# Altium project PCB_3.PrjPcb
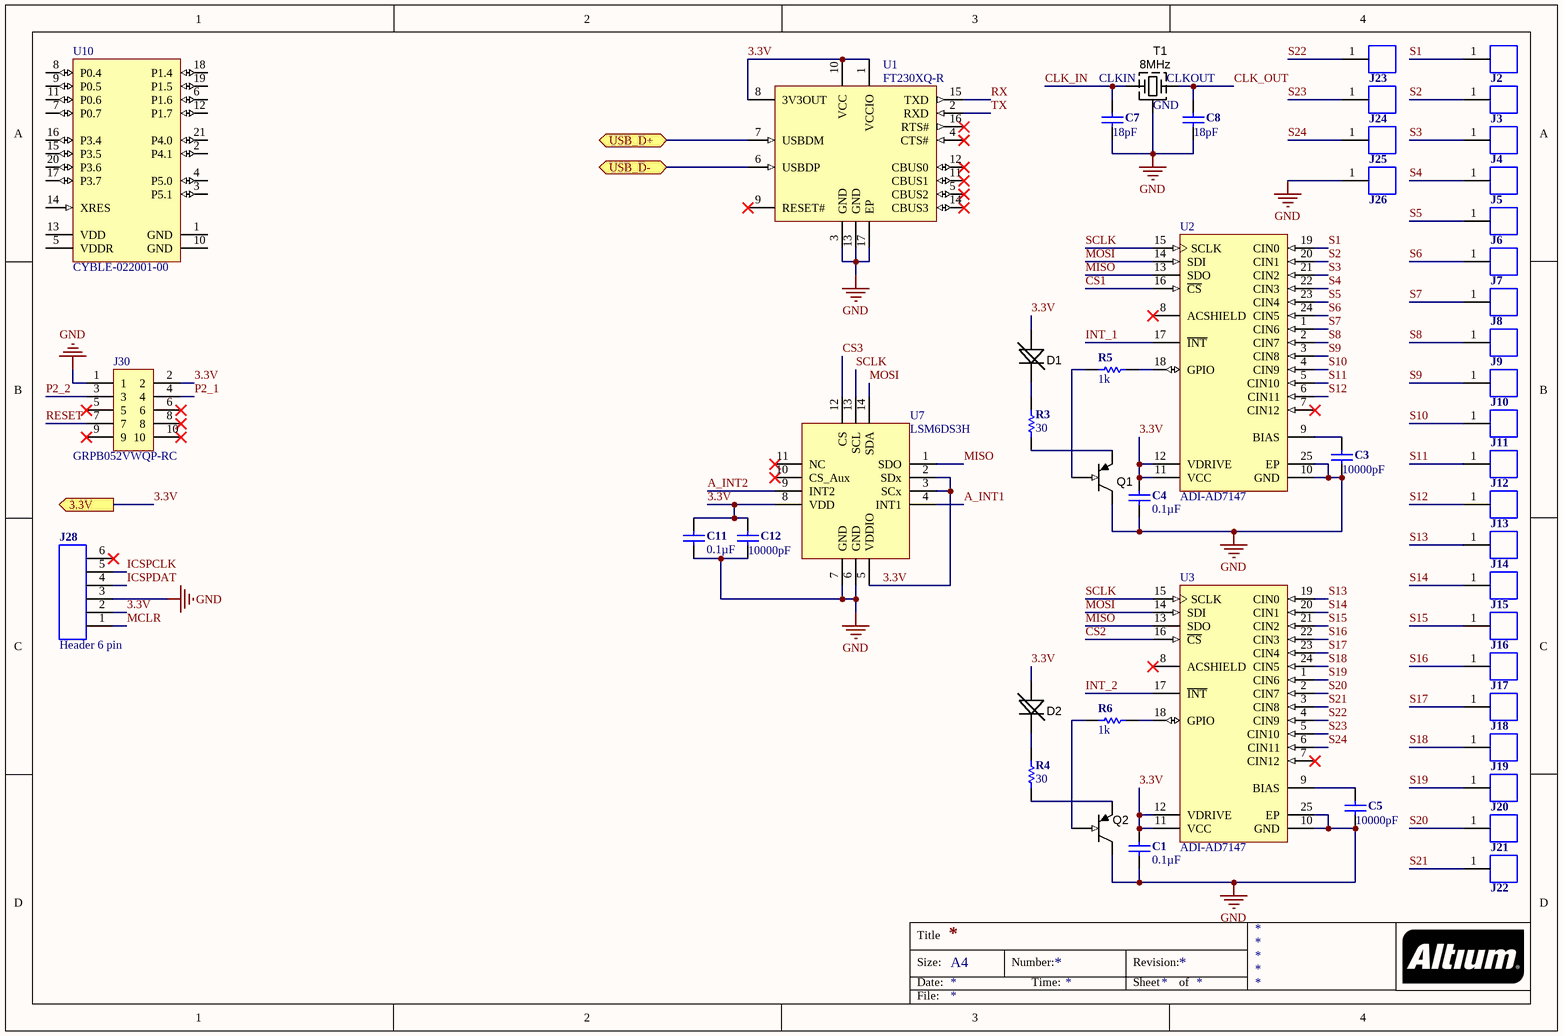
[diagram p0: Sheet-3.SchDoc]
2 sheets, 75 parts. Net scope: flat (ports and power ports of the same name join across sheets).
Board file: DB_3.PcbDoc
Sheets:
  Sheet-3.SchDoc
  Battery_3.SchDoc

## Sheet Sheet-3.SchDoc
size A4

### Parts
C1  0.1µF  [CAP-0805(2012)-R]
C3  10000pF  [CAP-0805(2012)-R]
C4  0.1µF  [CAP-0805(2012)-R]
C5  10000pF  [CAP-0805(2012)-R]
C7  18pF  [CAP-0805(2012)-R]
C8  18pF  [CAP-0805(2012)-R]
C11  0.1µF  [CAP-0805(2012)-R]
C12  10000pF  [CAP-0805(2012)-R]
D1  YELLOW  [LED-0805-A]  (value not drawn)
D2  YELLOW  [LED-0805-A]  (value not drawn)
J2  Conductive Thread  [THREAD_HOLE]  (value not drawn)
J3  Conductive Thread  [THREAD_HOLE]  (value not drawn)
J4  Conductive Thread  [THREAD_HOLE]  (value not drawn)
J5  Conductive Thread  [THREAD_HOLE]  (value not drawn)
J6  Conductive Thread  [THREAD_HOLE]  (value not drawn)
J7  Conductive Thread  [THREAD_HOLE]  (value not drawn)
J8  Conductive Thread  [THREAD_HOLE]  (value not drawn)
J9  Conductive Thread  [THREAD_HOLE]  (value not drawn)
J10  Conductive Thread  [THREAD_HOLE]  (value not drawn)
J11  Conductive Thread  [THREAD_HOLE]  (value not drawn)
J12  Conductive Thread  [THREAD_HOLE]  (value not drawn)
J13  Conductive Thread  [THREAD_HOLE]  (value not drawn)
J14  Conductive Thread  [THREAD_HOLE]  (value not drawn)
J15  Conductive Thread  [THREAD_HOLE]  (value not drawn)
J16  Conductive Thread  [THREAD_HOLE]  (value not drawn)
J17  Conductive Thread  [THREAD_HOLE]  (value not drawn)
J18  Conductive Thread  [THREAD_HOLE]  (value not drawn)
J19  Conductive Thread  [THREAD_HOLE]  (value not drawn)
J20  Conductive Thread  [THREAD_HOLE]  (value not drawn)
J21  Conductive Thread  [THREAD_HOLE]  (value not drawn)
J22  Conductive Thread  [THREAD_HOLE]  (value not drawn)
J23  Conductive Thread  [THREAD_HOLE]  (value not drawn)
J24  Conductive Thread  [THREAD_HOLE]  (value not drawn)
J25  Conductive Thread  [THREAD_HOLE]  (value not drawn)
J26  Conductive Thread  [THREAD_HOLE]  (value not drawn)
J28  Header 6 pin  [HEADER-6-100mil]
J30  GRPB052VWQP-RC  [GRPB052VWQP-RC]
Q1  (no value)  [SOT23-3]
Q2  (no value)  [SOT23-3]
R3  30  [R-0805(2012)-R]
R4  30  [R-0805(2012)-R]
R5  1k  [R-0805(2012)-R]
R6  1k  [R-0805(2012)-R]
T1  8MHz  [CRYSTAL-8MHZ]
U1  FT230XQ-R  [QFN-16]
U2  ADI-AD7147  [LFCSP_WQ]
U3  ADI-AD7147  [LFCSP_WQ]
U7  LSM6DS3H  [LGA-14]
U10  CYBLE-022001-00  [CYP-SP21_V]

### Ports
3.3V (out), USB_D+ (bidir), USB_D- (bidir)

### Nets
GND: C1.2 C3.2 C4.2 C5.2 C7.2 C8.2 C11.1 C12.1 J26.1 J28.3 J30.1 Q1.2(C) Q2.2(C) T1.2(GND) U1.3(GND) U1.13(GND) U1.17(EP) U2.10(GND) U2.25(EP) U3.10(GND) U3.25(EP) U7.6(GND) U7.7(GND)
3.3V: C1.1 C4.1 C11.2 C12.2 D1.A D2.A J28.2 J30.2 U1.1(VCCIO) U1.8(3V3OUT) U1.10(VCC) U2.11(VCC) U2.12(VDRIVE) U3.11(VCC) U3.12(VDRIVE) U7.2(SDx) U7.3(SCx) U7.5(VDDIO) U7.8(VDD) ; port 3.3V
A_INT1: U7.4(INT1)
A_INT2: U7.9(INT2)
CLK_IN: C7.1 T1.1(CLKIN)
CLK_OUT: C8.1 T1.3(X)
CS1: U2.16(~{CS})
CS2: U3.16(~{CS})
CS3: U7.12(CS)
ICSPCLK: J28.5
ICSPDAT: J28.4
INT_1: U2.17(~{INT})
INT_2: U3.17(~{INT})
MCLR: J28.1
MISO: U2.13(SDO) U3.13(SDO) U7.1(SDO)
MOSI: U2.14(SDI) U3.14(SDI) U7.14(SDA)
P2_1: J30.4
P2_2: J30.3
RESET: J30.7
RX: U1.15(TXD)
S1: J2.1 U2.19(CIN0)
S2: J3.1 U2.20(CIN1)
S3: J4.1 U2.21(CIN2)
S4: J5.1 U2.22(CIN3)
S5: J6.1 U2.23(CIN4)
S6: J7.1 U2.24(CIN5)
S7: J8.1 U2.1(CIN6)
S8: J9.1 U2.2(CIN7)
S9: J10.1 U2.3(CIN8)
S10: J11.1 U2.4(CIN9)
S11: J12.1 U2.5(CIN10)
S12: J13.1 U2.6(CIN11)
S13: J14.1 U3.19(CIN0)
S14: J15.1 U3.20(CIN1)
S15: J16.1 U3.21(CIN2)
S16: J17.1 U3.22(CIN3)
S17: J18.1 U3.23(CIN4)
S18: J19.1 U3.24(CIN5)
S19: J20.1 U3.1(CIN6)
S20: J21.1 U3.2(CIN7)
S21: J22.1 U3.3(CIN8)
S22: J23.1 U3.4(CIN9)
S23: J24.1 U3.5(CIN10)
S24: J25.1 U3.6(CIN11)
SCLK: U2.15(SCLK) U3.15(SCLK) U7.13(SCL)
TX: U1.2(RXD)
NetC3_1: C3.1 U2.9(BIAS)
NetC5_1: C5.1 U3.9(BIAS)
NetC9_2: U1.6(USBDP) ; port USB_D-
NetC10_2: U1.7(USBDM) ; port USB_D+
NetD1_K: D1.K R3.2
NetD2_K: D2.K R4.2
NetQ1_1: Q1.1(B) R5.1
NetQ1_3: Q1.3(E) R3.1
NetQ2_1: Q2.1(B) R6.2
NetQ2_3: Q2.3(E) R4.1
NetR5_2: R5.2 U2.18(GPIO)
NetR6_1: R6.1 U3.18(GPIO)

Not connected (* = marked no-connect by the designer): J28 6*; J30 5* 6* 8* 9* 10*; U1 4(CTS#)* 5(CBUS2)* 9(RESET#)* 11(CBUS1)* 12(CBUS0)* 14(CBUS3)* 16(RTS#)*; U2 7(CIN12)* 8(ACSHIELD)*; U3 7(CIN12)* 8(ACSHIELD)*; U7 10(CS_Aux)* 11(NC)*; U10 1(GND) 2(P4.1) 3(P5.1) 4(P5.0) 5(VDDR) 6(P1.6) 7(P0.7) 8(P0.4) 9(P0.5) 10(GND) 11(P0.6) 12(P1.7) 13(VDD) 14(XRES) 15(P3.5) 16(P3.4) 17(P3.7) 18(P1.4) 19(P1.5) 20(P3.6) 21(P4.0)

### Notes on the sheet
- Title
- Size:
- Date:
- A4
- Number:
- Time:
- Revision:
- Sheet
- of
- File:
- (in symbol CRYSTAL_8MHz) CLKOUT

### Library data of the parts
C1 C4 C11 = C-0805(2012): ___ OHM ___ mW 0805(2012) SMD; Manufacturer: Yageo; Manufacturer Part Number: CC0805KRX7R9BB104; Tolerance: ±10%; Voltage - Rated: 50V; Temperature Coefficient: X7R; Supplier 1: Digi-Key; Supplier Part Number 1: 311-1140-1-ND; RoHS: RoHS Compliant; Category: Capacitors; Packaging: Cut Tape (CT); Part Status: Active; Capacitance: 0.1µF; Operating Temperature: -55°C ~ 125°C; Features: -; Ratings: -; Applications: General Purpose; Failure Rate: -; Mounting Type: Surface Mount, MLCC; Package / Case: 0805 (2012 Metric); Size / Dimension: 0.079" L x 0.049" W (2.00mm x 1.25mm); Height - Seated (Max): -; Thickness (Max): 0.033" (0.85mm); Lead Spacing: -; Lead Style: -
  C1 C4: Stock 1: 1673347; Pricing 1: 1=0.1, 10=0.052, 25=0.0376, 50=0.0282, 100=0.023, 250=0.01928, 500=0.01646, 1000=0.01294 (USD); ComponentLink1URL: http://www.yageo.com/documents/recent/UPY-GPHC_X7R_6.3V-to-50V_16.pdf; ComponentLink1Description: http://www.yageo.com/documents/recent/UPY-GPHC_X7R_6.3V-to-50V_16.pdf
  C11: Stock 1: 1402266; Pricing 1: 1=0.1, 10=0.053, 25=0.0388, 50=0.029, 100=0.0237, 250=0.0198, 500=0.0169, 1000=0.01328 (USD); ComponentLink1URL: http://www.yageo.com/documents/recent/UPY-GPHC_X7R_6.3V-to-50V_17.pdf; ComponentLink1Description: http://www.yageo.com/documents/recent/UPY-GPHC_X7R_6.3V-to-50V_17.pdf
C3 C5 C12 = C-0805(2012): ___ OHM ___ mW 0805(2012) SMD; Manufacturer: Yageo; Manufacturer Part Number: CC0805KRX7R9BB103; Tolerance: ±10%; Voltage - Rated: 50V; Temperature Coefficient: X7R; Supplier 1: Digi-Key; Supplier Part Number 1: 311-1136-1-ND; RoHS: RoHS Compliant; Category: Capacitors; Packaging: Cut Tape (CT); Part Status: Active; Capacitance: 10000pF; Operating Temperature: -55°C ~ 125°C; Features: -; Ratings: -; Applications: General Purpose; Failure Rate: -; Mounting Type: Surface Mount, MLCC; Package / Case: 0805 (2012 Metric); Size / Dimension: 0.079" L x 0.049" W (2.00mm x 1.25mm); Height - Seated (Max): -; Thickness (Max): 0.024" (0.60mm); Lead Spacing: -; Lead Style: -
  C3 C5: Stock 1: 786089; Pricing 1: 1=0.1, 10=0.032, 25=0.0232, 50=0.0174, 100=0.0141, 250=0.01184, 500=0.0101, 1000=0.00794 (USD); ComponentLink1URL: http://www.yageo.com/documents/recent/UPY-GPHC_X7R_6.3V-to-50V_16.pdf; ComponentLink1Description: http://www.yageo.com/documents/recent/UPY-GPHC_X7R_6.3V-to-50V_16.pdf
  C12: Stock 1: 501331; Pricing 1: 1=0.1, 10=0.033, 25=0.0236, 50=0.0178, 100=0.0145, 250=0.01216, 500=0.01036, 1000=0.00814 (USD); ComponentLink1URL: http://www.yageo.com/documents/recent/UPY-GPHC_X7R_6.3V-to-50V_17.pdf; ComponentLink1Description: http://www.yageo.com/documents/recent/UPY-GPHC_X7R_6.3V-to-50V_17.pdf
C7 C8 = C-0805(2012): ___ OHM ___ mW 0805(2012) SMD; Manufacturer: Yageo; Manufacturer Part Number: CC0805JRNPO9BN180; Tolerance: ±5%; Voltage - Rated: 50V; Temperature Coefficient: C0G, NP0; Supplier 1: Digi-Key; Supplier Part Number 1: 311-1102-1-ND; RoHS: RoHS Compliant; Category: Capacitors; Stock 1: 101710; Pricing 1: 1=0.1, 10=0.055, 25=0.0396, 50=0.0298, 100=0.0243, 250=0.02032, 500=0.01734, 1000=0.01363 (USD); Packaging: Cut Tape (CT); Part Status: Active; Capacitance: 18pF; Operating Temperature: -55°C ~ 125°C; Features: -; Ratings: -; Applications: General Purpose; Failure Rate: -; Mounting Type: Surface Mount, MLCC; Package / Case: 0805 (2012 Metric); Size / Dimension: 0.079" L x 0.049" W (2.00mm x 1.25mm); Height - Seated (Max): -; Thickness (Max): 0.024" (0.60mm); Lead Spacing: -; Lead Style: -; ComponentLink1URL: http://www.yageo.com/NewPortal/yageodocoutput?fileName=/pdf/MLCC/UPY-GP_NP0_16V-to-50V_14.pdf; ComponentLink1Description: http://www.yageo.com/NewPortal/yageodocoutput?fileName=/pdf/MLCC/UPY-GP_NP0_16V-to-50V_14.pdf
D1 D2 = LED_0805_YELLOW: LED, 0805 SMD, YELLOW; Manufacturer: OSRAM Opto Semiconductors Inc.; Manufacturer Part Number: LY R976-PS-36; Lens Color: White; Lens Transparency: Diffused; Millicandela Rating: 162.5mcd; Lens Style/Size: Rectangle with Flat Top, 1.30mm x 1.25mm; Voltage - Forward (Vf) (Typ): 2V; Current - Test: 20mA; Viewing Angle: 160°; Wavelength - Dominant: 588nm; Wavelength - Peak: 591nm; Supplier 1: Digi-Key; RoHS: RoHS Compliant; Category: Optoelectronics; Stock 1: 77170; Pricing 1: 1=0.26, 10=0.19, 25=0.1396, 100=0.0998, 250=0.06788, 500=0.0599, 1000=0.04692 (USD); Packaging: Cut Tape (CT); Part Status: Active; Color: Yellow; Mounting Type: Surface Mount; Features: -; Package / Case: 0805 (2012 Metric); Supplier Device Package: 0805; Size / Dimension: 2.00mm L x 1.25mm W; Height (Max): 0.90mm; ComponentLink1URL: http://www.osram-os.com/Graphics/XPic9/00078941_0.pdf; ComponentLink1Description: http://www.osram-os.com/Graphics/XPic9/00078941_0.pdf; Supplier Part Number 1: 475-2560-1-ND
J2-J26 = CON-1_Pin_Thread: Header, 1 pin, Conductive Thread
J28 = CON-6Pin-100Mil: Header, 6 pin, .1 pitch; Manufacturer: Amphenol FCI; Manufacturer Part Number: 68000-406HLF; Number of Positions: 6; Pitch - Mating: 0.100" (2.54mm); Style: Board to Board; Shrouding: Unshrouded; Number of Positions Loaded: All; Contact Length - Mating: 0.230" (5.84mm); Contact Length - Post: 0.095" (2.41mm); Overall Contact Length: 0.425" (10.80mm); Material Flammability Rating: UL94 V-0; Supplier 1: Digi-Key; Category: Connectors, Interconnects; Stock 1: 11680; Pricing 1: 1=0.25, 10=0.233, 100=0.1615, 500=0.13662, 1000=0.11178, 5000=0.09936, 10000=0.09005 (USD); Current Rating: -; Number of Rows: 1; Contact Material: Phosphor Bronze; ComponentLink1URL: http://portal.fciconnect.com/Comergent//fci/drawing/68000.pdf; ComponentLink1Description: http://portal.fciconnect.com/Comergent//fci/drawing/68000.pdf; Supplier Part Number 1: 609-3263-ND; RoHS: RoHS Compliant; Packaging: Bulk; Part Status: Active; Connector Type: Header; Contact Type: Male Pin; Row Spacing - Mating: -; Mounting Type: Through Hole; Termination: Solder; Fastening Type: -; Insulation Height: 0.100" (2.54mm); Contact Shape: Square; Contact Finish - Mating: Tin; Contact Finish Thickness - Mating: 100µin (2.54µm); Contact Finish - Post: Tin; Insulation Material: -; Features: -; Operating Temperature: -; Ingress Protection: -; Insulation Color: Black; Voltage Rating: -; Mated Stacking Heights: -; Contact Finish Thickness - Post: -; Applications: -
J30 = GRPB052VWQP-RC: CONN HEADER .050" 10PS DL SMD AU; Manufacturer: Sullins Connector Solutions; Connector Type: Header, Unshrouded; Number of Positions: 10; Number of Positions Loaded: All; Pitch: 0.050" (1.27mm); Supplier 1: Digi-Key; Manufacturer Part Number: GRPB052VWQP-RC; RoHS: RoHS Compliant; Category: Connectors, Interconnects; Stock 1: 16500; Pricing 1: 1=1.3, 10=1.083, 25=1.0024, 50=0.9022, 100=0.802, 250=0.70176, 500=0.6416, 1000=0.58145, 2500=0.5213 (USD); Packaging: Bulk; Contact Type: Male Pin; Number of Rows: 2; Row Spacing: 0.050" (1.27mm); Contact Mating Length: 0.118" (3.00mm); Mounting Type: Surface Mount; Termination: Solder; Fastening Type: -; Features: Board Guide; Contact Finish: Gold; Contact Finish Thickness: Flash; Color: -; ComponentLink1URL: http://www.sullinscorp.com/catalogs/85_PAGE90-91_.050_MALE_HDR_ST_RA_SMT.pdf; ComponentLink1Description: http://www.sullinscorp.com/catalogs/85_PAGE90-91_.050_MALE_HDR_ST_RA_SMT.pdf; Supplier Part Number 1: S9013E-05-ND
Q1 Q2 = FMMT591CT-ND: Transistor PNP; Manufacturer: Diodes Incorporated; Manufacturer Part Number: FMMT591TA; Current - Collector (Ic) (Max): 1A; Voltage - Collector Emitter Breakdown (Max): 60V; Vce Saturation (Max) @ Ib, Ic: 350mV @ 100mA, 1A; Current - Collector Cutoff (Max): 100nA; DC Current Gain (hFE) (Min) @ Ic, Vce: 100 @ 500mA, 5V; Power - Max: 500mW; Frequency - Transition: 150MHz; Supplier 1: Digi-Key; RoHS: RoHS Compliant; Category: Discrete Semiconductor Products; Stock 1: 2485; Pricing 1: 1=0.45, 10=0.363, 100=0.2472, 500=0.1854, 1000=0.13905 (USD); Packaging: Cut Tape (CT); Part Status: Active; Transistor Type: PNP; Operating Temperature: -55°C ~ 150°C (TJ); Mounting Type: Surface Mount; Package / Case: TO-236-3, SC-59, SOT-23-3; Supplier Device Package: SOT-23-3; ComponentLink1URL: http://www.diodes.com/_files/datasheets/FMMT591.pdf; ComponentLink1Description: http://www.diodes.com/_files/datasheets/FMMT591.pdf; Supplier Part Number 1: FMMT591CT-ND
R3 R4 = R-0805(2012): ___ OHM ___ mW 0805(2012) SMD; Manufacturer: Yageo; Manufacturer Part Number: RC0805JR-0730RL; Tolerance: ±5%; Power (Watts): 0.125W, 1/8W; Temperature Coefficient: ±100ppm/°C; Supplier 1: Digi-Key; Supplier Part Number 1: 311-30ARCT-ND; RoHS: RoHS Compliant; Category: Resistors; Stock 1: 59788; Pricing 1: 1=0.1, 10=0.016, 25=0.0116, 50=0.009, 100=0.0066, 250=0.00504, 500=0.00404, 1000=0.00297 (USD); Packaging: Cut Tape (CT); Part Status: Active; Resistance (Ohms): 30; Composition: Thick Film; Features: Moisture Resistant; Operating Temperature: -55°C ~ 155°C; Package / Case: 0805 (2012 Metric); Supplier Device Package: 0805; Size / Dimension: 0.079" L x 0.049" W (2.00mm x 1.25mm); Height - Seated (Max): 0.024" (0.60mm); Failure Rate: -; ComponentLink1URL: http://www.yageo.com/documents/recent/PYu-RC_Group_51_RoHS_L_7.pdf; ComponentLink1Description: http://www.yageo.com/documents/recent/PYu-RC_Group_51_RoHS_L_7.pdf
R5 R6 = R-0805(2012): ___ OHM ___ mW 0805(2012) SMD; Manufacturer: Yageo; Manufacturer Part Number: RC0805JR-071KL; Tolerance: ±5%; Power (Watts): 0.125W, 1/8W; Temperature Coefficient: ±100ppm/°C; Supplier 1: Digi-Key; Supplier Part Number 1: 311-1.0KARCT-ND; RoHS: RoHS Compliant; Category: Resistors; Stock 1: 1174465; Pricing 1: 1=0.1, 10=0.016, 25=0.0116, 50=0.009, 100=0.0066, 250=0.00504, 500=0.00404, 1000=0.00297 (USD); Packaging: Cut Tape (CT); Part Status: Active; Resistance (Ohms): 1k; Composition: Thick Film; Features: Moisture Resistant; Operating Temperature: -55°C ~ 155°C; Package / Case: 0805 (2012 Metric); Supplier Device Package: 0805; Size / Dimension: 0.079" L x 0.049" W (2.00mm x 1.25mm); Height - Seated (Max): 0.024" (0.60mm); Failure Rate: -; ComponentLink1URL: http://www.yageo.com/documents/recent/PYu-RC_Group_51_RoHS_L_7.pdf; ComponentLink1Description: http://www.yageo.com/documents/recent/PYu-RC_Group_51_RoHS_L_7.pdf
T1 = CRYSTAL_8MHz: Oscillator Crystal 8MHz 10ppm; Manufacturer: Abracon LLC; Manufacturer Part Number: ABMM2-8.000MHZ-E2-T; Frequency Stability: ±20ppm; Load Capacitance: 18pF; Type: MHz Crystal; ESR (Equivalent Series Resistance): 72 Ohm; Operating Mode: Fundamental; Supplier 1: Digi-Key; RoHS: RoHS Compliant; Category: Crystals, Oscillators, Resonators; Stock 1: 56825; Pricing 1: 1=0.82, 10=0.721, 50=0.674, 100=0.5957, 500=0.5643 (USD); Frequency: 8MHz; Package / Case: 4-SMD, No Lead; Packaging: Cut Tape (CT); ComponentLink1URL: http://www.abracon.com/Resonators/ABMM2.pdf; ComponentLink1Description: http://www.abracon.com/Resonators/ABMM2.pdf; Supplier Part Number 1: 535-9628-1-ND; Part Status: Active; Frequency Tolerance: ±20ppm; Operating Temperature: -20°C ~ 70°C; Ratings: -; Mounting Type: Surface Mount; Size / Dimension: 0.240" L x 0.142" W (6.00mm x 3.60mm); Height - Seated (Max): 0.047" (1.20mm)
U1 = FT230XQ-R: USB to Basic UART Interface Chip, UHCI/OHCI/EHCI Compatible, USB 2.0 Compatible, -40 to +85 degC, 16-Pin QFN, Pb-Free, Tape and Reel; Manufacturer: FTDI, Future Technology Devices International Ltd; Function: Bridge, USB to UART; Standards: USB 2.0; Voltage - Supply: 3.3 V ~ 5 V; Current - Supply: 8mA; Supplier 1: Digi-Key; Manufacturer Part Number: FT230XQ-R; RoHS: RoHS Compliant; Category: Integrated Circuits (ICs); Stock 1: 40408; Pricing 1: 1=2.3, 25=1.97, 100=1.9, 250=1.71, 500=1.55, 1000=1.53001 (USD); Package / Case: 16-WQFN Exposed Pad; Packaging: Cut Tape (CT); ComponentLink1URL: http://www.ftdichip.com/Support/Documents/DataSheets/ICs/DS_FT230X.pdf; ComponentLink1Description: http://www.ftdichip.com/Support/Documents/DataSheets/ICs/DS_FT230X.pdf; Supplier Part Number 1: 768-1130-1-ND; Part Status: Active; Protocol: USB; Interface: UART; Operating Temperature: -40°C ~ 85°C; Supplier Device Package: 16-QFN (4x4)
U2 U3 = ADI-AD7147: Manufacturer: Analog Devices Inc.; Manufacturer Part Number: AD7147PACPZ-500R7; Resolution (Bits): 16 b; Sampling Rate (Per Second): 250k; Data Interface: SPI; Voltage Supply Source: Single Supply; Voltage - Supply: 2.6 V ~ 3.6 V; Supplier 1: Digi-Key; RoHS: RoHS Compliant; Category: Integrated Circuits (ICs); Stock 1: 559; Pricing 1: 1=3.6, 10=3.236, 100=2.6512 (USD); Packaging: Cut Tape (CT); Part Status: Active; Type: Capacitance-to-Digital Converter; Operating Temperature: -40°C ~ 85°C; Mounting Type: Surface Mount; Package / Case: 24-WFQFN Exposed Pad, CSP; Supplier Device Package: 24-LFCSP-WQ (4x4); ComponentLink1URL: http://www.analog.com/media/en/technical-documentation/data-sheets/AD7147.pdf; ComponentLink1Description: http://www.analog.com/media/en/technical-documentation/data-sheets/AD7147.pdf; Supplier Part Number 1: AD7147PACPZ-500R7CT-ND
U7 = LSM6DS3H: 3D accelerometer and 3D gyroscope; Manufacturer: STMicroelectronics; Manufacturer Part Number: LSM6DS3HTR; Sensor Type: Accelerometer, Gyroscope, Temperature, 6 Axis; Output Type: I²C, SPI; Supplier 1: Digi-Key; RoHS: RoHS Compliant; Category: Sensors, Transducers; Stock 1: 34853; Pricing 1: 1=3.98, 10=3.572, 100=2.9264 (USD); Part Status: Active; Operating Temperature: -40°C ~ 85°C (TA); ComponentLink1URL: http://www.st.com/content/ccc/resource/technical/document/datasheet/group0/38/96/79/af/ab/62/42/c3/DM00229854/files/DM00229854.pdf/jcr:content/translations/en.DM00229854.pdf; ComponentLink1Description: http://www.st.com/content/ccc/resource/technical/document/datasheet/group0/38/96/79/af/ab/62/42/c3/DM00229854/files/DM00229854.pdf/jcr:content/translations/en.DM00229854.pdf; Supplier Part Number 1: 497-16367-1-ND
U10 = CMP-2000-05093-1: RF Transceiver Module, 128 kB Flash, -40 to 85 degC, 21-Pin Module, RoHS; Manufacturer: CypressSemiconductorCorp; Antenna Type: Integrated,Chip; Voltage - Supply: 1.8V~4.5V; Power - Output: 3dBm; Data Rate: 1Mbps; Memory Size: 128kBFlash,16kBSRAM; Sensitivity: -91dBm; Frequency: 2.4GHz; Current - Transmitting: 15.6mA; Serial Interfaces: I²C,SPI,UART; Current - Receiving: 16.4mA; RF Family/Standard: Bluetooth; Protocol: Bluetoothv4.1; Modulation: -; Mounting Type: SurfaceMount; Datasheet URL: http://www.cypress.com/file/140791/download; Datasheet Version: Rev. *E, 02/2016; Package / Case: Module; Category: RF/IFandRFID; Manufacturer URL: http://www.cypress.com/; Series: EZ-BLE™PRoC™; Packaging: Tape&amp;Reel(TR); Operating Temperature: -40degC~85degC; Family: RFTransceiverModules

## Sheet Battery_3.SchDoc
size A4
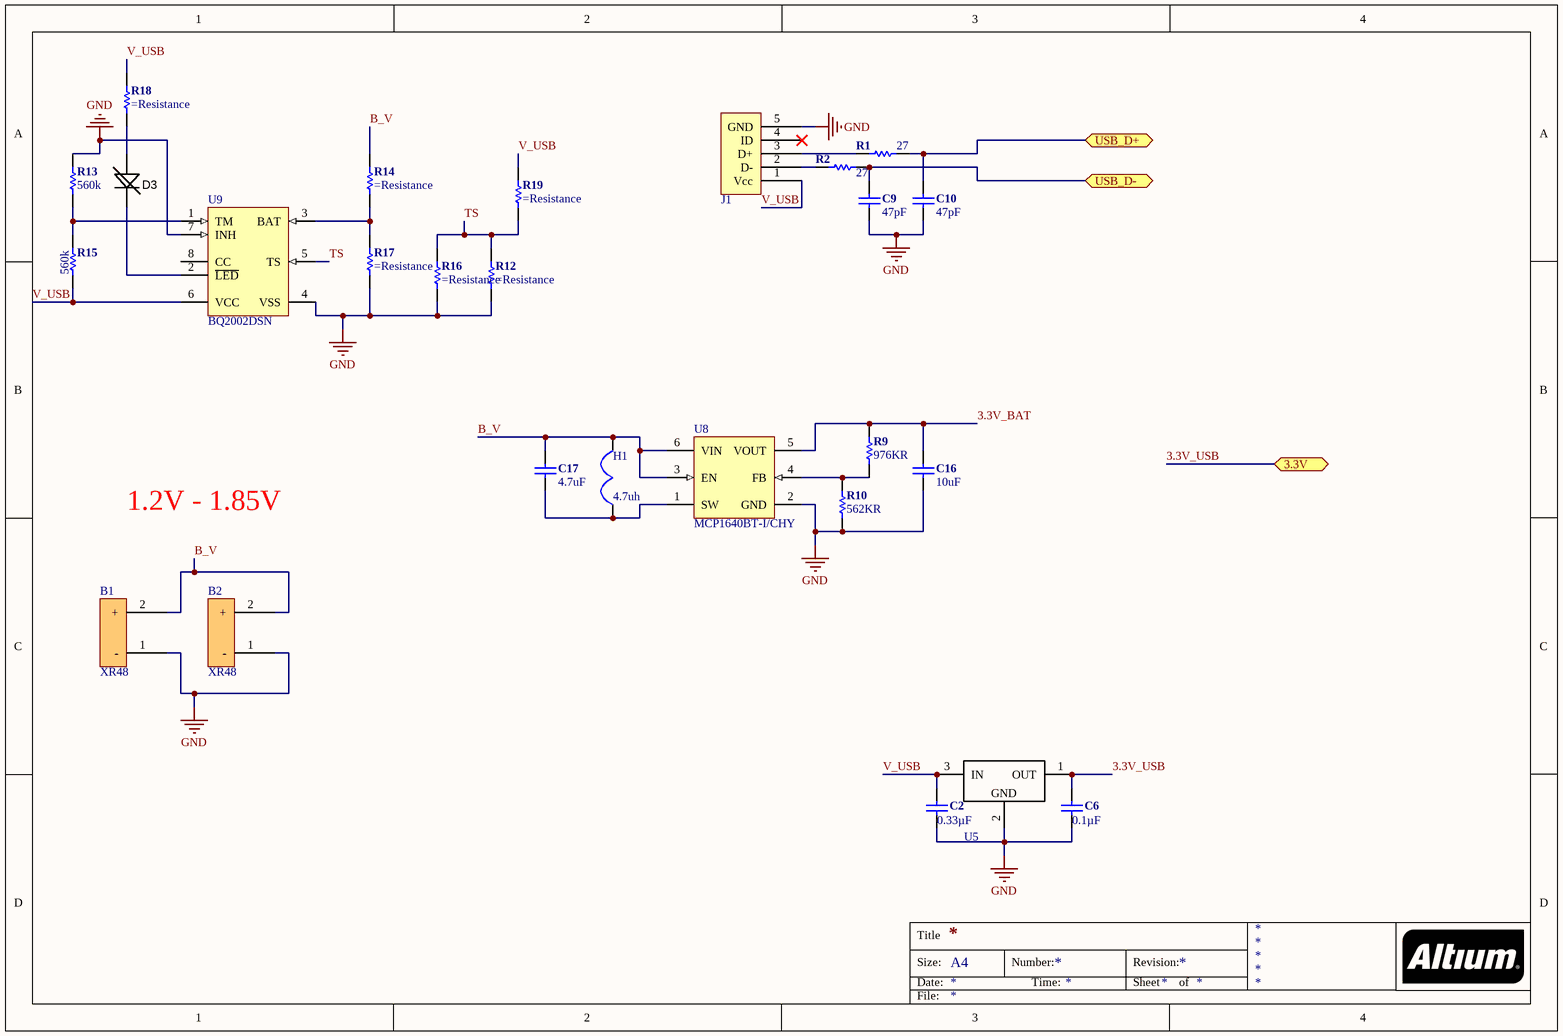
[diagram p1: Battery_3.SchDoc]

### Parts
B1  XR48  [XR48]
B2  XR48  [XR48]
C2  0.33µF  [CAP-0805(2012)-R]
C6  0.1µF  [CAP-0805(2012)-R]
C9  47pF  [CAP-0805(2012)-R]
C10  47pF  [CAP-0805(2012)-R]
C16  10uF  [CAP-0805(2012)-R]
C17  4.7uF  [CAP-0805(2012)-R]
D3  Red  [LED-0805-A]  (value not drawn)
H1  Inductance: 4.7uh  [H-0805(2012)-H]  (hidden comment: H-0805(2012))
J1  USB  [USB_Connector_5P_MICRO_USB_FCI]  (value not drawn)
R1  27  [R-0805(2012)-R]
R2  27  [R-0805(2012)-R]
R9  976KR  [R-0805(2012)-R]
R10  562KR  [R-0805(2012)-R]
R12  (no value)  [R-0805(2012)-R]
R13  560k  [R-0805(2012)-R]
R14  (no value)  [R-0805(2012)-R]
R15  560k  [R-0805(2012)-R]
R16  (no value)  [R-0805(2012)-R]
R17  (no value)  [R-0805(2012)-R]
R18  (no value)  [R-0805(2012)-R]
R19  (no value)  [R-0805(2012)-R]
U5  L78L33ACUTR  [SOT89-3]  (value not drawn)
U8  MCP1640BT-I/CHY  [MCHP-SOT-23-CHY6_L]
U9  BQ2002DSN  [D0008A_M]

### Ports
3.3V, USB_D+ (bidir), USB_D- (bidir)

### Nets
GND: B1.1(-) B2.1(-) C2.2 C6.2 C9.1 C10.1 C16.2 J1.5(GND) R10.2 R12.2 R13.1 R16.2 R17.2 U5.2(GND) U8.2(GND) U9.4(VSS) U9.7(INH)
3.3V_BAT: C16.1 R9.1 U8.5(VOUT)
3.3V_USB: C6.1 U5.1(OUT) ; port 3.3V  [project net 3.3V]
B_V: B1.2(+) B2.2(+) C17.1 H1.2 R14.1 U8.3(EN) U8.6(VIN)
TS: R12.1 R16.1 R19.2 U9.5(TS)
V_USB: C2.1 J1.1(Vcc) R15.2 R18.1 R19.1 U5.3(IN) U9.6(VCC)
NetC9_2: C9.2 R2.2 ; port USB_D-
NetC10_2: C10.2 R1.2 ; port USB_D+
NetC17_2: C17.2 H1.1 U8.1(SW)
NetD3_A: D3.A R18.2
NetD3_K: D3.K U9.2(~{LED})
NetJ1_2: J1.2(D-) R2.1
NetJ1_3: J1.3(D+) R1.1
NetR9_2: R9.2 R10.1 U8.4(FB)
NetR13_2: R13.2 R15.1 U9.1(TM)
NetR14_2: R14.2 R17.1 U9.3(BAT)

Not connected (* = marked no-connect by the designer): J1 4(ID)*; U9 8(CC)

### Notes on the sheet
- 1.2V - 1.85V
- Title
- Size:
- Date:
- A4
- Number:
- Time:
- Revision:
- Sheet
- of
- File:

### Library data of the parts
C2 = C-0805(2012): ___ OHM ___ mW 0805(2012) SMD; Manufacturer: Yageo; Manufacturer Part Number: CC0805KKX7R7BB334; Tolerance: ±10%; Voltage - Rated: 16V; Temperature Coefficient: X7R; Supplier 1: Digi-Key; Supplier Part Number 1: 311-1882-1-ND; RoHS: RoHS Compliant; Category: Capacitors; Stock 1: 5738; Pricing 1: 1=0.19, 10=0.129, 25=0.0948, 50=0.0776, 100=0.0655, 250=0.05344, 500=0.04482, 1000=0.03965 (USD); Packaging: Cut Tape (CT); Part Status: Active; Capacitance: 0.33µF; Operating Temperature: -55°C ~ 125°C; Features: -; Ratings: -; Applications: General Purpose; Failure Rate: -; Mounting Type: Surface Mount, MLCC; Package / Case: 0805 (2012 Metric); Size / Dimension: 0.079" L x 0.049" W (2.00mm x 1.25mm); Height - Seated (Max): -; Thickness (Max): 0.057" (1.45mm); Lead Spacing: -; Lead Style: -; ComponentLink1URL: http://www.yageo.com/documents/recent/UPY-GPHC_X7R_6.3V-to-50V_16.pdf; ComponentLink1Description: http://www.yageo.com/documents/recent/UPY-GPHC_X7R_6.3V-to-50V_16.pdf
C6 = C-0805(2012): as C1 on sheet Sheet-3; Supplier 1: Digi-Key; Supplier Part Number 1: 311-1140-1-ND; RoHS: RoHS Compliant; Category: Capacitors; Stock 1: 1673292; Pricing 1: 1=0.1, 10=0.052, 25=0.0376, 50=0.0282, 100=0.023, 250=0.01928, 500=0.01646, 1000=0.01294 (USD); Packaging: Cut Tape (CT); Part Status: Active; Capacitance: 0.1µF; Operating Temperature: -55°C ~ 125°C; Features: -; Ratings: -; Applications: General Purpose; Failure Rate: -; Mounting Type: Surface Mount, MLCC; Package / Case: 0805 (2012 Metric); Size / Dimension: 0.079" L x 0.049" W (2.00mm x 1.25mm); Height - Seated (Max): -; Thickness (Max): 0.033" (0.85mm); Lead Spacing: -; Lead Style: -; ComponentLink1URL: http://www.yageo.com/documents/recent/UPY-GPHC_X7R_6.3V-to-50V_16.pdf; ComponentLink1Description: http://www.yageo.com/documents/recent/UPY-GPHC_X7R_6.3V-to-50V_16.pdf
C9 C10 = C-0805(2012): ___ OHM ___ mW 0805(2012) SMD; Manufacturer: Yageo; Manufacturer Part Number: CC0805JRNPO9BN470; Tolerance: ±5%; Voltage - Rated: 50V; Temperature Coefficient: C0G, NP0; Supplier 1: Digi-Key; Supplier Part Number 1: 311-1107-1-ND; RoHS: RoHS Compliant; Category: Capacitors; Stock 1: 181638; Pricing 1: 1=0.1, 10=0.055, 25=0.0396, 50=0.0298, 100=0.0243, 250=0.02032, 500=0.01734, 1000=0.01363 (USD); Packaging: Cut Tape (CT); Part Status: Active; Capacitance: 47pF; Operating Temperature: -55°C ~ 125°C; Features: -; Ratings: -; Applications: General Purpose; Failure Rate: -; Mounting Type: Surface Mount, MLCC; Package / Case: 0805 (2012 Metric); Size / Dimension: 0.079" L x 0.049" W (2.00mm x 1.25mm); Height - Seated (Max): -; Thickness (Max): 0.024" (0.60mm); Lead Spacing: -; Lead Style: -; ComponentLink1URL: http://www.yageo.com/NewPortal/yageodocoutput?fileName=/pdf/MLCC/UPY-GP_NP0_16V-to-50V_14.pdf; ComponentLink1Description: http://www.yageo.com/NewPortal/yageodocoutput?fileName=/pdf/MLCC/UPY-GP_NP0_16V-to-50V_14.pdf
C16 = C-0805(2012): ___ OHM ___ mW 0805(2012) SMD; Manufacturer: Murata; Manufacturer Part Number: GRM219R61A106KE44D; Material: Ceramic; Voltage Rating: 10V; Tolerance: 10%; Dielectric: X5R; Supplier 1: Mouser; Supplier Part Number 1: 81-GRM219R61A106KE4D; Stock 1: 105901; Pricing 1: 1=0.2, 10=0.084, 50=0.084, 100=0.057, 1000=0.043, 10000=0.03 (USD); Mount: Surface Mount; Case/Package: 0805; Case Code (Metric): 2012; Case Code (Imperial): 0805; Min Operating Temperature: -55°C; Max Operating Temperature: 85°C; Package Quantity: 1; Capacitance: 10uF; Packaging: Tape and Reel; Voltage Rating (DC): 10V; Termination: SMD/SMT; Voltage: 10V; Length: 2mm; Height: 0.85mm; Width: 1.25mm; Thickness: 0.037inch; Depth: 1.25mm; Radiation Hardening: No; REACH SVHC: No SVHC; Lead Free: Lead Free; ComponentLink1URL: https://datasheet.ciiva.com/172/grm219r61a106ke44-01-172352.pdf; ComponentLink1Description: https://datasheet.ciiva.com/172/grm219r61a106ke44-01-172352.pdf; ComponentLink2URL: https://datasheet.ciiva.com/172/grm219r61a106ke44-01-172353.pdf; ComponentLink2Description: https://datasheet.ciiva.com/172/grm219r61a106ke44-01-172353.pdf; ComponentLink3URL: https://datasheet.ciiva.com/172/grm219r61a106ke44-01-172354.pdf; ComponentLink3Description: https://datasheet.ciiva.com/172/grm219r61a106ke44-01-172354.pdf; ComponentLink4URL: https://datasheet.ciiva.com/5414/product-5414357.pdf; ComponentLink4Description: https://datasheet.ciiva.com/5414/product-5414357.pdf; ComponentLink5URL: https://datasheet.ciiva.com/3777/54grm219r61a106ke4423-3777910.pdf; ComponentLink5Description: https://datasheet.ciiva.com/3777/54grm219r61a106ke4423-3777910.pdf; ComponentLink6URL: https://datasheet.ciiva.com/7719/c02e-7719062.pdf; ComponentLink6Description: https://datasheet.ciiva.com/7719/c02e-7719062.pdf; ComponentLink7URL: https://datasheet.ciiva.com/2989/product-2989663.pdf; ComponentLink7Description: https://datasheet.ciiva.com/2989/product-2989663.pdf; ComponentLink8URL: https://datasheet.ciiva.com/17451/product-17451791.pdf; ComponentLink8Description: https://datasheet.ciiva.com/17451/product-17451791.pdf
C17 = C-0805(2012): ___ OHM ___ mW 0805(2012) SMD; Manufacturer: Murata; Manufacturer Part Number: GRM21BR61C475KA88L; Tolerance: 10%; Voltage Rating: 16V; Dielectric: X5R; Supplier 1: Mouser; Supplier Part Number 1: 81-GRM21BR61C475KA8L; Stock 1: 95997; Pricing 1: 1=0.2, 10=0.076, 50=0.076, 100=0.053, 1000=0.037, 10000=0.027 (USD); Mount: Surface Mount; Case/Package: 0805; Case Code (Imperial): 0805; Case Code (Metric): 2012; Min Operating Temperature: -55°C; Max Operating Temperature: 85°C; Packaging: Tape and Reel; Capacitance: 4.7uF; Voltage Rating (DC): 16V; Package Quantity: 1; Termination: SMD/SMT; Voltage: 16V; Length: 2mm; Height: 1.25mm; Width: 1.25mm; Thickness: 0.053inch; Depth: 1.25mm; Radiation Hardening: No; REACH SVHC: No SVHC; Lead Free: Lead Free; ComponentLink1URL: https://datasheet.ciiva.com/2989/product-2989699.pdf; ComponentLink1Description: https://datasheet.ciiva.com/2989/product-2989699.pdf; ComponentLink2URL: https://datasheet.ciiva.com/2989/product-2989700.pdf; ComponentLink2Description: https://datasheet.ciiva.com/2989/product-2989700.pdf; ComponentLink3URL: https://datasheet.ciiva.com/16199/product-16199957.pdf; ComponentLink3Description: https://datasheet.ciiva.com/16199/product-16199957.pdf; ComponentLink4URL: https://datasheet.ciiva.com/16624/product-16624469.pdf; ComponentLink4Description: https://datasheet.ciiva.com/16624/product-16624469.pdf; ComponentLink5URL: https://datasheet.ciiva.com/22706/608985-22706821.pdf; ComponentLink5Description: https://datasheet.ciiva.com/22706/608985-22706821.pdf; ComponentLink6URL: https://datasheet.ciiva.com/3777/grm21br61c475ka8823-3777176.pdf; ComponentLink6Description: https://datasheet.ciiva.com/3777/grm21br61c475ka8823-3777176.pdf; ComponentLink7URL: https://datasheet.ciiva.com/137/product-137674.pdf; ComponentLink7Description: https://datasheet.ciiva.com/137/product-137674.pdf; ComponentLink8URL: https://datasheet.ciiva.com/137/product-137675.pdf; ComponentLink8Description: https://datasheet.ciiva.com/137/product-137675.pdf; ComponentLink9URL: https://datasheet.ciiva.com/137/product-137676.pdf; ComponentLink9Description: https://datasheet.ciiva.com/137/product-137676.pdf
D3 = LED_0805_RED: LED, 0805 SMD, Red; Manufacturer: OSRAM Opto Semiconductors Inc.; Manufacturer Part Number: LS R976-NR-1; Lens Color: White; Lens Transparency: Diffused; Millicandela Rating: 104mcd; Lens Style/Size: Rectangle with Flat Top, 1.30mm x 1.25mm; Voltage - Forward (Vf) (Typ): 2V; Current - Test: 20mA; Viewing Angle: 160°; Wavelength - Dominant: 633nm; Wavelength - Peak: 645nm; Supplier 1: Digi-Key; RoHS: RoHS Compliant; Category: Optoelectronics; Stock 1: 162363; Pricing 1: 1=0.26, 10=0.19, 25=0.1396, 100=0.0998, 250=0.06788, 500=0.0599, 1000=0.04692 (USD); Packaging: Cut Tape (CT); Part Status: Active; Color: Red; Mounting Type: Surface Mount; Features: -; Package / Case: 0805 (2012 Metric); Size / Dimension: 2.00mm L x 1.25mm W; Height (Max): 0.90mm; ComponentLink1URL: http://www.osram-os.com/Graphics/XPic8/00078896_0.pdf; ComponentLink1Description: http://www.osram-os.com/Graphics/XPic8/00078896_0.pdf; Supplier Part Number 1: 475-1278-1-ND
H1 = H-0805(2012): Manufacturer: TDK; Manufacturer Part Number: MLP2012S4R7MT0S1; Description: FIXED IND 4.7UH 700MA 260 MOHM; Core Material: Ferrite; Tolerance: 20%; Current Rating: 700mA; Shielding: Shielded; DC Resistance (DCR): 260mR; Test Frequency: 2MHz; Supplier 1: Mouser; Supplier Part Number 1: 810-MLP2012S4R7MT0S1; Stock 1: 5251; Pricing 1: 1=0.36, 10=0.254, 50=0.254, 100=0.236, 1000=0.167, 10000=0.112 (USD); Case/Package: 0805; Case Code (Metric): 2012; Case Code (Imperial): 0805; Min Operating Temperature: -40°C; Max Operating Temperature: 125°C; Package Quantity: 4000; Packaging: Tape and Reel; Length: 0.079inch; Width: 0.049inch; Height - Seated (Max): 0.039inch; ComponentLink1URL: https://datasheet.ciiva.com/41798/inductor-commercial-power-mlp-en-41798601.pdf; ComponentLink1Description: https://datasheet.ciiva.com/41798/inductor-commercial-power-mlp-en-41798601.pdf
J1 = USB: USB_Connector_5P_MICRO_USB_FCI; Manufacturer: Amphenol FCI; Manufacturer Part Number: 10118194-0001LF; Connector Type: USB - micro B; Current Rating: 1.8A per Contact; Gender: Receptacle; Number of Contacts: 5; Specifications: USB 2.0; Number of Ports: 1; Voltage - Rated: 100VAC; Mating Cycles: 10000; Shielding: Shielded; Material Flammability Rating: UL94 V-0; Supplier 1: Digi-Key; RoHS: RoHS Compliant; Category: Connectors, Interconnects; Stock 1: 267893; Pricing 1: 1=0.46, 10=0.437, 25=0.3744, 50=0.318, 100=0.3056, 250=0.27444, 500=0.26196 (USD); Packaging: Cut Tape (CT); ComponentLink1URL: http://portal.fciconnect.com/Comergent//fci/drawing/10118194.pdf; ComponentLink1Description: http://portal.fciconnect.com/Comergent//fci/drawing/10118194.pdf; Supplier Part Number 1: 609-4618-1-ND; Part Status: Active; Mounting Type: Surface Mount, Right Angle; Through Hole; Mounting Feature: Horizontal; Termination: Solder; Features: Solder Retention; Ingress Protection: -; Operating Temperature: -30°C ~ 80°C; Contact Finish: Gold; Shell/Shielding Material: Steel, Stainless; Insulation Color: Black
R1 R2 = R-0805(2012): ___ OHM ___ mW 0805(2012) SMD; Manufacturer: Yageo; Manufacturer Part Number: RC0805JR-0727RL; Tolerance: ±5%; Power (Watts): 0.125W, 1/8W; Temperature Coefficient: ±100ppm/°C; Supplier 1: Digi-Key; Supplier Part Number 1: 311-27ARCT-ND; RoHS: RoHS Compliant; Category: Resistors; Stock 1: 89837; Pricing 1: 1=0.1, 10=0.016, 25=0.0116, 50=0.009, 100=0.0066, 250=0.00504, 500=0.00404, 1000=0.00297 (USD); Packaging: Cut Tape (CT); Part Status: Active; Resistance (Ohms): 27; Composition: Thick Film; Features: Moisture Resistant; Operating Temperature: -55°C ~ 155°C; Package / Case: 0805 (2012 Metric); Supplier Device Package: 0805; Size / Dimension: 0.079" L x 0.049" W (2.00mm x 1.25mm); Height - Seated (Max): 0.024" (0.60mm); Failure Rate: -; ComponentLink1URL: http://www.yageo.com/documents/recent/PYu-RC_Group_51_RoHS_L_7.pdf; ComponentLink1Description: http://www.yageo.com/documents/recent/PYu-RC_Group_51_RoHS_L_7.pdf
R9 = R-0805(2012): ___ OHM ___ mW 0805(2012) SMD; Manufacturer: Panasonic ECG; Manufacturer Part Number: ERJ-6ENF9763V; Power Rating: 125mW; Tolerance: 1%; Voltage Rating: 150V; Temperature Coefficient: 100ppm/°C; Supplier 1: Mouser; Supplier Part Number 1: 667-ERJ-6ENF9763V; Stock 1: 48708; Pricing 1: 1=0.1, 10=0.022, 50=0.022, 100=0.009, 1000=0.007, 10000=0.004 (USD); Mount: Surface Mount; Case/Package: 0805; Case Code (Metric): 2012; Case Code (Imperial): 0805; Contact Plating: Tin; Min Operating Temperature: -55°C; Max Operating Temperature: 155°C; Resistance: 976KR; Packaging: Tape and Reel; Package Quantity: 1; Composition: Thick Film; Number of Terminations: 2; Termination: SMD/SMT; Max Power Dissipation: 125mW; Voltage Rating (DC): 150V; Length: 2mm; Height: 0.6mm; Width: 0.049inch; Depth: 1.25mm; REACH SVHC: Yes; Lead Free: Lead Free; ComponentLink1URL: https://datasheet.ciiva.com/16776/70260748-16776101.pdf; ComponentLink1Description: https://datasheet.ciiva.com/16776/70260748-16776101.pdf; ComponentLink2URL: https://datasheet.ciiva.com/9179/aoa0000ce2-9179366.pdf; ComponentLink2Description: https://datasheet.ciiva.com/9179/aoa0000ce2-9179366.pdf; ComponentLink3URL: https://datasheet.ciiva.com/16758/70260748-16758678.pdf; ComponentLink3Description: https://datasheet.ciiva.com/16758/70260748-16758678.pdf; ComponentLink4URL: https://datasheet.ciiva.com/46438/1678782-46438408.pdf; ComponentLink4Description: https://datasheet.ciiva.com/46438/1678782-46438408.pdf; ComponentLink5URL: https://datasheet.ciiva.com/22668/1678782-22668460.pdf; ComponentLink5Description: https://datasheet.ciiva.com/22668/1678782-22668460.pdf
R10 = R-0805(2012): ___ OHM ___ mW 0805(2012) SMD; Manufacturer: Vishay; Manufacturer Part Number: CRCW0805562KFKEA; Power Rating: 125mW; Tolerance: 1%; Voltage Rating: 150V; Temperature Coefficient: 100ppm/°C; Supplier 1: Mouser; Supplier Part Number 1: 71-CRCW0805-562K-E3; Stock 1: 9712; Pricing 1: 1=0.1, 10=0.049, 50=0.049, 100=0.028, 1000=0.019, 10000=0.007 (USD); Case/Package: 0805; Number of Pins: 2; Weight: 0.000194oz; Case Code (Imperial): 0805; Case Code (Metric): 2012; Contact Plating: Tin; Min Operating Temperature: -55°C; Max Operating Temperature: 155°C; Resistance: 562KR; Packaging: Tape and Reel; Package Quantity: 10; Composition: Thick Film; Number of Terminations: 2; Military Standard: Not; Max Power Dissipation: 125mW; Length: 2mm; Height: 0.02inch; Width: 1.25mm; Depth: 1.25mm; Radiation Hardening: No; REACH SVHC: Unknown; ComponentLink1URL: https://datasheet.ciiva.com/22706/1697337-22706277.pdf; ComponentLink1Description: https://datasheet.ciiva.com/22706/1697337-22706277.pdf; ComponentLink2URL: https://datasheet.ciiva.com/2525/dcrcwe3-2525767.pdf; ComponentLink2Description: https://datasheet.ciiva.com/2525/dcrcwe3-2525767.pdf; ComponentLink3URL: https://datasheet.ciiva.com/2525/dcrcwe3-2525768.pdf; ComponentLink3Description: https://datasheet.ciiva.com/2525/dcrcwe3-2525768.pdf; ComponentLink4URL: https://datasheet.ciiva.com/2525/dcrcwe3-2525769.pdf; ComponentLink4Description: https://datasheet.ciiva.com/2525/dcrcwe3-2525769.pdf; ComponentLink5URL: https://datasheet.ciiva.com/8928/dcrcwe3-8928345.pdf; ComponentLink5Description: https://datasheet.ciiva.com/8928/dcrcwe3-8928345.pdf; ComponentLink6URL: https://datasheet.ciiva.com/17160/dcrcwe3-17160041.pdf; ComponentLink6Description: https://datasheet.ciiva.com/17160/dcrcwe3-17160041.pdf; ComponentLink7URL: https://datasheet.ciiva.com/22674/1847332-22674793.pdf; ComponentLink7Description: https://datasheet.ciiva.com/22674/1847332-22674793.pdf; ComponentLink8URL: https://datasheet.ciiva.com/7670/1697337-7670907.pdf; ComponentLink8Description: https://datasheet.ciiva.com/7670/1697337-7670907.pdf; ComponentLink9URL: https://datasheet.ciiva.com/7670/1697337-7670908.pdf; ComponentLink9Description: https://datasheet.ciiva.com/7670/1697337-7670908.pdf; ComponentLink10URL: https://datasheet.ciiva.com/16204/dcrcwe3-16204271.pdf; ComponentLink10Description: https://datasheet.ciiva.com/16204/dcrcwe3-16204271.pdf
R12-R19 = R-0805(2012): ___ OHM ___ mW 0805(2012) SMD
  R13 R15: Resistance: 560k
U5 = L78L33ACUTR: Manufacturer: STMicroelectronics; Regulator Topology: Positive Fixed; Voltage - Output: 3.3V; Current - Output: 100mA; Voltage - Dropout (Typical): 1.7V @ 40mA; Voltage - Input: Up to 30V; Supplier 1: Digi-Key; Manufacturer Part Number: L78L33ACUTR; RoHS: RoHS Compliant; Category: Integrated Circuits (ICs); Stock 1: 46216; Pricing 1: 1=0.43, 10=0.349, 100=0.2373, 500=0.17798, 1000=0.13349 (USD); Packaging: Cut Tape (CT); Part Status: Active; Current - Limit (Min): -; Operating Temperature: 0°C ~ 125°C; Mounting Type: Surface Mount; Package / Case: TO-243AA; Supplier Device Package: SOT-89-3; ComponentLink1URL: http://www.st.com/content/ccc/resource/technical/document/datasheet/15/55/e5/aa/23/5b/43/fd/CD00000446.pdf/files/CD00000446.pdf/jcr:content/translations/en.CD00000446.pdf; ComponentLink1Description: http://www.st.com/content/ccc/resource/technical/document/datasheet/15/55/e5/aa/23/5b/43/fd/CD00000446.pdf/files/CD00000446.pdf/jcr:content/translations/en.CD00000446.pdf; Supplier Part Number 1: 497-1200-1-ND
U8 = CMP-0139-00285-1: Start-up Synchronous Boost Regulator with True Output Disconnect or Input / Output Bypass Option, 350 mA, Input Voltage 0.65 to 5.5 V, Output Voltage 2.0 to 5.5 V, -40 to 85 degC, 6-pin SOT-23 (CHY6), Tape and Reel; Manufacturer: Microchip; Description: IC REG BST ADJ 0.1A SYNC SOT23-6; Max Supply Voltage: 5.5V; Min Supply Voltage: 650mV; Number of Outputs: 1; Output Current: 350mA; Frequency: 500KHz; Efficiency: 96%; Min Output Voltage: 2V; Supplier 1: Mouser; Supplier Part Number 1: 579-MCP1640BT-I/CHY; Manufacturer Part Number: MCP1640BT-I/CHY; Stock 1: 12237; Pricing 1: 1=0.62, 10=0.57, 50=0.48, 100=0.44, 1000=0.44, 10000=0.44 (USD); Case/Package: SOT-23; Number of Pins: 6; Contact Plating: Tin; Min Operating Temperature: -40°C; Max Operating Temperature: 85°C; Output Voltage: 5.5V; Min Input Voltage: 650mV; Packaging: Tape and Reel; Max Input Voltage: 5.5V; Switching Frequency: 500KHz; Package Quantity: 3000; Max Output Current: 350mA; Max Output Voltage: 5.5V; Length: 3.1mm; Height: 1.3mm; Width: 1.8mm; Radiation Hardening: No; REACH SVHC: No SVHC; Lead Free: Lead Free; ComponentLink1URL: https://datasheet.ciiva.com/17368/22234b-17368709.pdf; ComponentLink1Description: https://datasheet.ciiva.com/17368/22234b-17368709.pdf; ComponentLink2URL: https://datasheet.ciiva.com/7994/1669480-7994598.pdf; ComponentLink2Description: https://datasheet.ciiva.com/7994/1669480-7994598.pdf; ComponentLink3URL: https://datasheet.ciiva.com/14150/mcp1640-eng-datasheet-14150779.pdf; ComponentLink3Description: https://datasheet.ciiva.com/14150/mcp1640-eng-datasheet-14150779.pdf; ComponentLink4URL: https://datasheet.ciiva.com/22711/1669480-22711102.pdf; ComponentLink4Description: https://datasheet.ciiva.com/22711/1669480-22711102.pdf; ComponentLink5URL: https://datasheet.ciiva.com/29305/651405-da-01-en-ic-reg-mcp1640bt-i-chy-sot-23-6-mcp-29305435.pdf; ComponentLink5Description: https://datasheet.ciiva.com/29305/651405-da-01-en-ic-reg-mcp1640bt-i-chy-sot-23-6-mcp-29305435.pdf
U9 = CMP-0321-00383-2: NiCd / NiMH Charge Controller with dT / dt Termination, 4 V, 0 to 70 degC, 8-pin SOIC (D), Green (RoHS & no Sb/Br); Manufacturer: Texas Instruments; NiMH: Y; Lead Acid: N; Vin(Min)(V): 4; SubFamily: Battery Charge Management; Description: IC CONTROLLER FASTCHRGE 8-SOIC; Supply Voltage: 5V; Min Supply Voltage: 4V; Max Supply Voltage: 6V; Output Current: 2A; Operating Supply Current: 500uA; ComponentLink1URL: http://www.ti.com/general/docs/lit/getliterature.tsp?genericPartNumber=BQ2002D&fileType=pdf; PackageDescription: 8-Pin Plastic Small Outline Integrated Circuit, 4.9 x 3.9 mm, Pitch 1.27 mm Pitch; ComponentLink1Description: Datasheet; PartNumber: BQ2002DSN; PackageReference: D0008A; NiCd: Y; Over Voltage Protection: N; PackageVersion: revM, Jun-2011; Mounting Technology: Surface Mount; DatasheetVersion: SLUS133; Code_JEDEC: MS-012AA; Li-Polymer: N; Eco-Plan: Green (RoHS & no Sb/Br); Li-Ion: N; Supplier 1: Mouser; Supplier Part Number 1: 595-BQ2002DSN; Manufacturer Part Number: BQ2002DSN; Stock 1: 290; Pricing 1: 1=2.81, 10=2.52, 50=2.4, 100=2.03, 1000=1.19, 10000=1.19 (USD); Case/Package: SOIC; Number of Pins: 8; Weight: 0.002561oz; Contact Plating: Gold; Min Operating Temperature: 0°C; Max Operating Temperature: 70°C; Packaging: Rail/Tube; Package Quantity: 75; Min Input Voltage: 4V; Length: 4.9mm; Height: 1.58mm; Width: 3.91mm; Radiation Hardening: No; Lead Free: Lead Free; ComponentLink2URL: https://datasheet.ciiva.com/15114/getdatasheetpartid-517178-15114929.pdf; ComponentLink2Description: https://datasheet.ciiva.com/15114/getdatasheetpartid-517178-15114929.pdf; ComponentLink3URL: https://datasheet.ciiva.com/3213/bq2002t-3213543.pdf; ComponentLink3Description: https://datasheet.ciiva.com/3213/bq2002t-3213543.pdf; ComponentLink4URL: https://datasheet.ciiva.com/1933/bq2002d-1933224.pdf; ComponentLink4Description: https://datasheet.ciiva.com/1933/bq2002d-1933224.pdf

## Nets that join several sheets
GND: Sheet-3 (23 pins), Battery_3 (17 pins)
3.3V: Sheet-3 (19 pins), Battery_3 (C6.1 U5.1)
NetC9_2: Sheet-3 (U1.6), Battery_3 (C9.2 R2.2)
NetC10_2: Sheet-3 (U1.7), Battery_3 (C10.2 R1.2)